# Altium schematic sheet Sheet1.SchDoc
size A
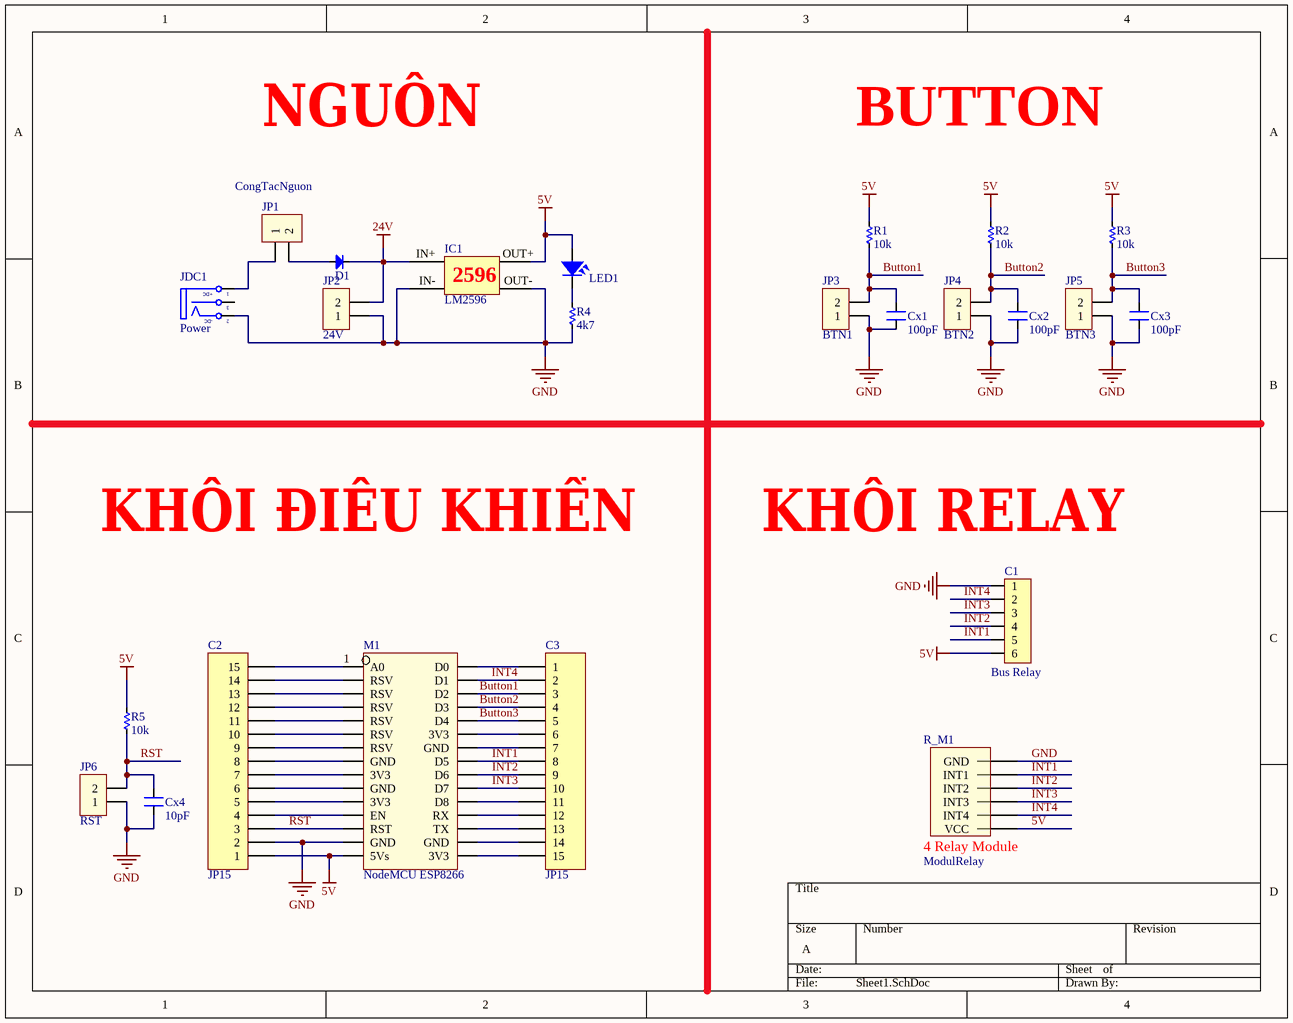
[diagram p0: Sheet1.SchDoc]

## Parts
C1  Bus Relay  [Header6]
C2  JP15  [JP15-C1T]
C3  JP15  [JP15-C1T]
Cx1  100pF  [CN1.5]
Cx2  100pF  [CN1.5]
Cx3  100pF  [CN1.5]
Cx4  10pF  [CN1.5]
D1  Diode  [DIO-5A]  (value not drawn)
IC1  LM2596  [LM2596]
JDC1  Power  [DC0]
JP1  CongTacNguon  [Header-2P]
JP2  24V  [Header-2P]
JP3  BTN1  [Header-2P]
JP4  BTN2  [Header-2P]
JP5  BTN3  [Header-2P]
JP6  RST  [Header-2P]
LED1  LED  [LED-3MM-YELLOW]  (value not drawn)
M1  NodeMCU ESP8266  [NodeMCU ESP8266]
R1  10k  [RES-1/4W]
R2  10k  [RES-1/4W]
R3  10k  [RES-1/4W]
R4  4k7  [RES-1/8WD]
R5  10k  [RES-1/4W]
R_M1  ModulRelay  [Relay_4_Modul]

## Nets
5V: C1.6 C2.1 IC1.OUT+ LED1.1 M1.15(5Vs) R1.1 R2.1 R3.1 R5.1 R_M1.1(VCC)
24V: D1.2(K) IC1.IN+ JP2.2
GND: C1.1 C2.2 Cx1.1 Cx2.1 Cx3.1 Cx4.1 IC1.IN- IC1.OUT- JDC1.2(TN) JP2.1 JP3.1 JP4.1 JP5.1 JP6.1 M1.14(GND) R4.1 R_M1.6(GND)
Button1: C3.3 Cx1.2 JP3.2 M1.28(D2) R1.2
Button2: C3.4 Cx2.2 JP4.2 M1.27(D3) R2.2
Button3: C3.5 Cx3.2 JP5.2 M1.26(D4) R3.2
INT1: C1.5 C3.8 M1.23(D5) R_M1.5(INT1)
INT2: C1.4 C3.9 M1.22(D6) R_M1.4(INT2)
INT3: C1.3 C3.10 M1.21(D7) R_M1.3(INT3)
INT4: C1.2 C3.2 M1.29(D1) R_M1.2(INT4)
RST: C2.3 Cx4.2 JP6.2 M1.13(RST) R5.2
NetC2_4: C2.4 M1.12(EN)
NetC2_5: C2.5 M1.11(3V3)
NetC2_6: C2.6 M1.10(GND)
NetC2_7: C2.7 M1.9(3V3)
NetC2_8: C2.8 M1.8(GND)
NetC2_9: C2.9 M1.7(RSV)
NetC2_10: C2.10 M1.6(RSV)
NetC2_11: C2.11 M1.5(RSV)
NetC2_12: C2.12 M1.4(RSV)
NetC2_13: C2.13 M1.3(RSV)
NetC2_14: C2.14 M1.2(RSV)
NetC2_15: C2.15 M1.1(A0)
NetC3_1: C3.1 M1.30(D0)
NetC3_6: C3.6 M1.25(3V3)
NetC3_7: C3.7 M1.24(GND)
NetC3_11: C3.11 M1.20(D8)
NetC3_12: C3.12 M1.19(RX)
NetC3_13: C3.13 M1.18(TX)
NetC3_14: C3.14 M1.17(GND)
NetC3_15: C3.15 M1.16(3V3)
NetD1_1: D1.1(A) JP1.2
NetJDC1_1: JDC1.1(T) JP1.1
NetLED1_2: LED1.2 R4.2

Not connected (* = marked no-connect by the designer): JDC1 3(S)

## Notes on the sheet
- NGUỒN
- BUTTON
- KHỐI ĐIỀU KHIỂN
- (near C1) KHỐI RELAY
- (in symbol DCIN) +DC; -DC
- (in symbol LM2596) 2596
- (in symbol Modul_Relay_4Chan) 4 Relay Module

## Library data of the parts
C1 = Header6: Header IDC, 6 x 1 Pin Vertical 2.54mm Pitch (Non-Boxed, Male); Manufacturer: W¨¹rth Elektronik eiSos GmbH; partNo: 613002143121; ComponentLink1 Description: Manufacturer; ComponentLink2 Description: Datasheet; NoPins: 02; Created Date: 29 March 2013; ComponentLink1URL: http://www.we-online.com; ComponentLink2URL: http://katalog.we-online.de/em/datasheet/6130xx143121.pdf; Created by: Karrer Zheng
C2 C3 = JP15: WR-PHD 2.54 mm Angled Socket Header; Manufacturer: W¨¹rth Elektronik eiSos GmbH; partNo: 613015143121; ComponentLink1 Description: Manufacturer; ComponentLink2 Description: Datasheet; NoPins: 15; Created Date: 29 March 2013; ComponentLink1URL: http://www.we-online.com; ComponentLink2URL: http://katalog.we-online.de/em/datasheet/6130xx143121.pdf; Created by: Karrer Zheng
Cx1-Cx4 = CN: Value: 33pF
D1 = Diode: Default Diode; Code - JEDEC: DO-214-AB; Value: 1N5007; Published: 8-Jun-2000; Revision: July-2002: Re-released for DXP Platform.; Publisher: Altium Limited
JDC1 = DCIN: Jac DC input; Value: Jac DC
JP1-JP6 = Header-2P
LED1 = LED: LED Single colour Green and Red; Value: LED 3 ly Single Colour
R1-R5 = Res: Manufacturer: Generic Components; Class: Passive; SubClass: R; Published: 08/06/2000; Publisher: Altium Hobart Technology Centre
R_M1 = Modul_Relay_4Chan